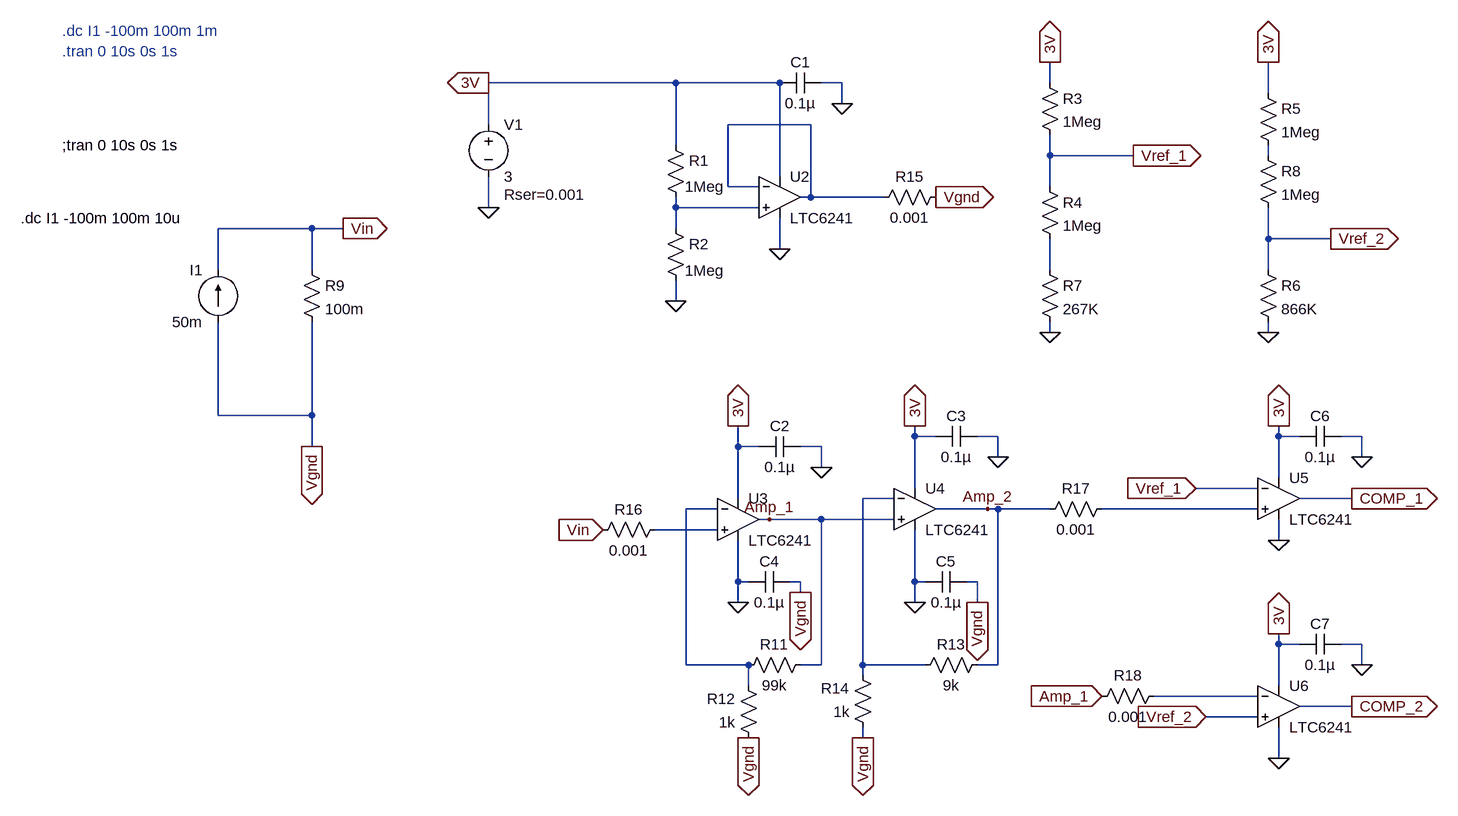
[diagram p0: schematic CurrentMonitorWithLED_SingleMode.asc]
CurrentMonitorWithLED_SingleMode.asc, the LTspice schematic file:
Version 4
SHEET 1 2296 1248
WIRE -144 -64 -432 -64
WIRE 16 -64 -144 -64
WIRE 112 -64 80 -64
WIRE 432 -64 432 -96
WIRE 768 -48 768 -96
WIRE 112 -32 112 -64
WIRE -432 0 -432 -64
WIRE 64 0 -64 0
WIRE -144 32 -144 -64
WIRE 432 48 432 16
WIRE 560 48 432 48
WIRE 768 48 768 32
WIRE 16 80 16 -64
WIRE -64 96 -64 0
WIRE -16 96 -64 96
WIRE 432 96 432 48
WIRE 64 112 64 0
WIRE 64 112 48 112
WIRE 176 112 64 112
WIRE -432 128 -432 80
WIRE -144 128 -144 112
WIRE -16 128 -144 128
WIRE -704 160 -848 160
WIRE -656 160 -704 160
WIRE -144 160 -144 128
WIRE 768 176 768 128
WIRE 864 176 768 176
WIRE 16 192 16 144
WIRE -848 224 -848 160
WIRE -704 224 -704 160
WIRE 432 224 432 176
WIRE 768 224 768 176
WIRE -144 272 -144 240
WIRE 432 320 432 304
WIRE 768 320 768 304
WIRE -848 448 -848 304
WIRE -704 448 -704 304
WIRE -704 448 -848 448
WIRE 224 480 224 464
WIRE 256 480 224 480
WIRE 352 480 320 480
WIRE 784 480 784 464
WIRE 816 480 784 480
WIRE 912 480 880 480
WIRE -704 496 -704 448
WIRE -48 496 -48 464
WIRE -16 496 -48 496
WIRE 80 496 48 496
WIRE 352 512 352 480
WIRE 912 512 912 480
WIRE 80 528 80 496
WIRE 784 544 784 480
WIRE 224 560 224 480
WIRE 752 560 656 560
WIRE -48 576 -48 496
WIRE 192 576 144 576
WIRE 896 576 816 576
WIRE -80 592 -128 592
WIRE 336 592 256 592
WIRE 352 592 336 592
WIRE 432 592 352 592
WIRE 752 592 512 592
WIRE 0 608 -16 608
WIRE 80 608 0 608
WIRE 192 608 80 608
WIRE -80 624 -176 624
WIRE 784 640 784 608
WIRE -48 704 -48 640
WIRE -32 704 -48 704
WIRE 48 704 32 704
WIRE 224 704 224 624
WIRE 240 704 224 704
WIRE 320 704 304 704
WIRE 48 720 48 704
WIRE -48 736 -48 704
WIRE 224 736 224 704
WIRE 320 736 320 704
WIRE 784 800 784 784
WIRE 816 800 784 800
WIRE 912 800 880 800
WIRE -128 832 -128 592
WIRE -32 832 -128 832
WIRE 80 832 80 608
WIRE 80 832 48 832
WIRE 144 832 144 576
WIRE 240 832 144 832
WIRE 352 832 352 592
WIRE 352 832 320 832
WIRE 912 832 912 800
WIRE 144 848 144 832
WIRE -32 864 -32 832
WIRE 784 864 784 800
WIRE 752 880 592 880
WIRE 896 896 816 896
WIRE 752 912 672 912
WIRE 144 944 144 928
WIRE 784 976 784 928
FLAG -432 128 0
FLAG -432 -64 3V
IOPIN -432 -64 Out
FLAG 432 320 0
FLAG 768 320 0
FLAG 432 -96 3V
IOPIN 432 -96 Out
FLAG 768 -96 3V
IOPIN 768 -96 Out
FLAG 560 48 Vref_1
IOPIN 560 48 Out
FLAG 864 176 Vref_2
IOPIN 864 176 Out
FLAG -656 160 Vin
IOPIN -656 160 Out
FLAG -48 464 3V
IOPIN -48 464 Out
FLAG -48 736 0
FLAG -256 624 Vin
IOPIN -256 624 In
FLAG -32 944 Vgnd
IOPIN -32 944 Out
FLAG -704 496 Vgnd
IOPIN -704 496 Out
FLAG 224 464 3V
IOPIN 224 464 Out
FLAG 224 736 0
FLAG 144 944 Vgnd
IOPIN 144 944 Out
FLAG 0 608 Amp_1
FLAG 336 592 Amp_2
FLAG 48 720 Vgnd
IOPIN 48 720 Out
FLAG 320 736 Vgnd
IOPIN 320 736 Out
FLAG 80 528 0
FLAG 352 512 0
FLAG 672 912 Vref_2
IOPIN 672 912 In
FLAG 784 464 3V
IOPIN 784 464 Out
FLAG 912 512 0
FLAG 784 640 0
FLAG 784 976 0
FLAG 784 784 3V
IOPIN 784 784 Out
FLAG 912 832 0
FLAG 656 560 Vref_1
IOPIN 656 560 In
FLAG 512 880 Amp_1
IOPIN 512 880 In
FLAG 896 576 COMP_1
IOPIN 896 576 Out
FLAG 896 896 COMP_2
IOPIN 896 896 Out
FLAG -144 272 0
FLAG 16 192 0
FLAG 256 112 Vgnd
IOPIN 256 112 Out
FLAG 112 -32 0
DATAFLAG -288 -64 "round($*1k)/1k"
DATAFLAG 544 48 "round($*1k)/1k"
DATAFLAG 816 176 "round($*1k)/1k"
DATAFLAG -704 352 "round(I(R9)*1k)/1k"
DATAFLAG -160 624 "round($*1k)/1k"
DATAFLAG -768 160 "round($*1k)/1k"
DATAFLAG 80 608 "round($*1k)/1k"
DATAFLAG -304 -32 "round(I(V1)*1Meg)/1Meg"
DATAFLAG 352 656 "round($*1k)/1k"
DATAFLAG 160 112 "round($*1k)/1k"
DATAFLAG 208 176 "round(I(R15)*1Meg)/1Meg"
DATAFLAG 16 48 "round(Ix(U5:V+)*1G)/1G"
SYMBOL voltage -432 -16 R0
WINDOW 123 0 0 Left 2
WINDOW 39 24 124 Left 2
SYMATTR SpiceLine Rser=0.001
SYMATTR InstName V1
SYMATTR Value 3
SYMBOL res 416 -80 R0
SYMATTR InstName R3
SYMATTR Value 1Meg
SYMBOL res 416 80 R0
SYMATTR InstName R4
SYMATTR Value 1Meg
SYMBOL res 752 -64 R0
SYMATTR InstName R5
SYMATTR Value 1Meg
SYMBOL res 752 208 R0
SYMATTR InstName R6
SYMATTR Value 866K
SYMATTR SpiceLine tol=1 pwr=0.1
SYMBOL res 416 208 R0
SYMATTR InstName R7
SYMATTR Value 267K
SYMATTR SpiceLine tol=1 pwr=0.1
SYMBOL res 752 32 R0
SYMATTR InstName R8
SYMATTR Value 1Meg
SYMATTR SpiceLine tol=1 pwr=0.1
SYMBOL res -720 208 R0
SYMATTR InstName R9
SYMATTR Value 100m
SYMBOL res 64 816 R90
WINDOW 0 0 56 VBottom 2
WINDOW 3 32 56 VTop 2
SYMATTR InstName R11
SYMATTR Value 99k
SYMBOL res -16 960 R180
WINDOW 0 36 76 Left 2
WINDOW 3 36 40 Left 2
SYMATTR InstName R12
SYMATTR Value 1k
SYMBOL res 336 816 R90
WINDOW 0 0 56 VBottom 2
WINDOW 3 32 56 VTop 2
SYMATTR InstName R13
SYMATTR Value 9k
SYMBOL res 160 944 R180
WINDOW 0 36 76 Left 2
WINDOW 3 36 40 Left 2
SYMATTR InstName R14
SYMATTR Value 1k
SYMBOL cap 48 480 R90
WINDOW 0 0 32 VBottom 2
WINDOW 3 32 32 VTop 2
SYMATTR InstName C2
SYMATTR Value 0.1µ
SYMATTR SpiceLine V=25 Irms=2.1 Rser=0.0606238 Lser=0 mfg="KEMET" pn="C1210C104K3RAC" type="X7R"
SYMBOL cap 320 464 R90
WINDOW 0 0 32 VBottom 2
WINDOW 3 32 32 VTop 2
SYMATTR InstName C3
SYMATTR Value 0.1µ
SYMATTR SpiceLine V=25 Irms=2.1 Rser=0.0606238 Lser=0 mfg="KEMET" pn="C1210C104K3RAC" type="X7R"
SYMBOL cap 32 688 R90
WINDOW 0 0 32 VBottom 2
WINDOW 3 32 32 VTop 2
SYMATTR InstName C4
SYMATTR Value 0.1µ
SYMATTR SpiceLine V=25 Irms=2.1 Rser=0.0606238 Lser=0 mfg="KEMET" pn="C1210C104K3RAC" type="X7R"
SYMBOL cap 304 688 R90
WINDOW 0 0 32 VBottom 2
WINDOW 3 32 32 VTop 2
SYMATTR InstName C5
SYMATTR Value 0.1µ
SYMATTR SpiceLine V=25 Irms=2.1 Rser=0.0606238 Lser=0 mfg="KEMET" pn="C1210C104K3RAC" type="X7R"
SYMBOL cap 880 464 R90
WINDOW 0 0 32 VBottom 2
WINDOW 3 32 32 VTop 2
SYMATTR InstName C6
SYMATTR Value 0.1µ
SYMATTR SpiceLine V=25 Irms=2.1 Rser=0.0606238 Lser=0 mfg="KEMET" pn="C1210C104K3RAC" type="X7R"
SYMBOL cap 880 784 R90
WINDOW 0 0 32 VBottom 2
WINDOW 3 32 32 VTop 2
SYMATTR InstName C7
SYMATTR Value 0.1µ
SYMATTR SpiceLine V=25 Irms=2.1 Rser=0.0606238 Lser=0 mfg="KEMET" pn="C1210C104K3RAC" type="X7R"
SYMBOL res -160 608 R90
WINDOW 0 0 56 VBottom 2
WINDOW 3 32 56 VTop 2
SYMATTR InstName R16
SYMATTR Value 0.001
SYMATTR SpiceLine tol=1 pwr=0.1
SYMBOL res 528 576 R90
WINDOW 0 0 56 VBottom 2
WINDOW 3 32 56 VTop 2
SYMATTR InstName R17
SYMATTR Value 0.001
SYMATTR SpiceLine tol=1 pwr=0.1
SYMBOL res 608 864 R90
WINDOW 0 0 56 VBottom 2
WINDOW 3 32 56 VTop 2
SYMATTR InstName R18
SYMATTR Value 0.001
SYMATTR SpiceLine tol=1 pwr=0.1
SYMBOL res -160 16 R0
WINDOW 3 30 80 Left 2
SYMATTR Value 1Meg
SYMATTR InstName R1
SYMBOL res -160 144 R0
WINDOW 3 30 81 Left 2
SYMATTR Value 1Meg
SYMATTR InstName R2
SYMBOL cap 80 -80 R90
WINDOW 0 0 32 VBottom 2
WINDOW 3 32 32 VTop 2
SYMATTR InstName C1
SYMATTR Value 0.1µ
SYMATTR SpiceLine V=25 Irms=2.1 Rser=0.0606238 Lser=0 mfg="KEMET" pn="C1210C104K3RAC" type="X7R"
SYMBOL res 272 96 R90
WINDOW 0 0 56 VBottom 2
WINDOW 3 32 56 VTop 2
SYMATTR InstName R15
SYMATTR Value 0.001
SYMATTR SpiceLine tol=1 pwr=0.1
SYMBOL current -848 304 R180
WINDOW 0 24 80 Left 2
WINDOW 3 24 0 Left 2
WINDOW 123 0 0 Left 2
WINDOW 39 0 0 Left 2
SYMATTR InstName I1
SYMATTR Value 50m
SYMBOL Opamps\\LTC6241 16 112 R0
SYMATTR InstName U2
SYMBOL Opamps\\LTC6241 -48 608 R0
SYMATTR InstName U3
SYMBOL Opamps\\LTC6241 224 592 R0
SYMATTR InstName U4
SYMBOL Opamps\\LTC6241 784 576 R0
SYMATTR InstName U5
SYMBOL Opamps\\LTC6241 784 896 R0
SYMATTR InstName U6
TEXT -1152 144 Left 2 !.dc I1 -100m 100m 10u
TEXT -1088 -144 Left 2 ;.dc I1 -100m 100m 1m\n.tran 0 10s 0s 1s
TEXT -1088 32 Left 2 !;tran 0 10s 0s 1s

The netlist it stands for:
* CurrentMonitorWithLED_SingleMode.asc
V1 3V 0 3 Rser=0.001
R3 3V Vref_1 1Meg
R4 Vref_1 N004 1Meg
R5 3V N002 1Meg
R6 Vref_2 0 866K tol=1 pwr=0.1
R7 N004 0 267K tol=1 pwr=0.1
R8 N002 Vref_2 1Meg tol=1 pwr=0.1
R9 Vin Vgnd 100m
R11 Amp_1 N006 99k
R12 Vgnd N006 1k
R13 Amp_2 N005 9k
R14 Vgnd N005 1k
C2 0 3V 0.1µ V=25 Irms=2.1 Rser=0.0606238 Lser=0 mfg="KEMET" pn="C1210C104K3RAC" type="X7R"
C3 0 3V 0.1µ V=25 Irms=2.1 Rser=0.0606238 Lser=0 mfg="KEMET" pn="C1210C104K3RAC" type="X7R"
C4 Vgnd 0 0.1µ V=25 Irms=2.1 Rser=0.0606238 Lser=0 mfg="KEMET" pn="C1210C104K3RAC" type="X7R"
C5 Vgnd 0 0.1µ V=25 Irms=2.1 Rser=0.0606238 Lser=0 mfg="KEMET" pn="C1210C104K3RAC" type="X7R"
C6 0 3V 0.1µ V=25 Irms=2.1 Rser=0.0606238 Lser=0 mfg="KEMET" pn="C1210C104K3RAC" type="X7R"
C7 0 3V 0.1µ V=25 Irms=2.1 Rser=0.0606238 Lser=0 mfg="KEMET" pn="C1210C104K3RAC" type="X7R"
R16 N008 Vin 0.001 tol=1 pwr=0.1
R17 N007 Amp_2 0.001 tol=1 pwr=0.1
R18 N009 Amp_1 0.001 tol=1 pwr=0.1
R1 3V N003 1Meg
R2 N003 0 1Meg
C1 0 3V 0.1µ V=25 Irms=2.1 Rser=0.0606238 Lser=0 mfg="KEMET" pn="C1210C104K3RAC" type="X7R"
R15 Vgnd N001 0.001 tol=1 pwr=0.1
I1 Vgnd Vin 50m
XU2 N003 N001 3V 0 N001 LTC6241  ; pins In+ In- V+ V- OUT
XU3 N008 N006 3V 0 Amp_1 LTC6241  ; pins In+ In- V+ V- OUT
XU4 Amp_1 N005 3V 0 Amp_2 LTC6241  ; pins In+ In- V+ V- OUT
XU5 N007 Vref_1 3V 0 COMP_1 LTC6241  ; pins In+ In- V+ V- OUT
XU6 Vref_2 N009 3V 0 COMP_2 LTC6241  ; pins In+ In- V+ V- OUT
.dc I1 -100m 100m 10u
* .dc I1 -100m 100m 1m
* .tran 0 10s 0s 1s
;tran 0 10s 0s 1s
.lib LTC4.lib
.backanno
.end